# EAGLE schematic bc-module-bridge (EAGLE 7.7.0)

## Sheet 1 of 2
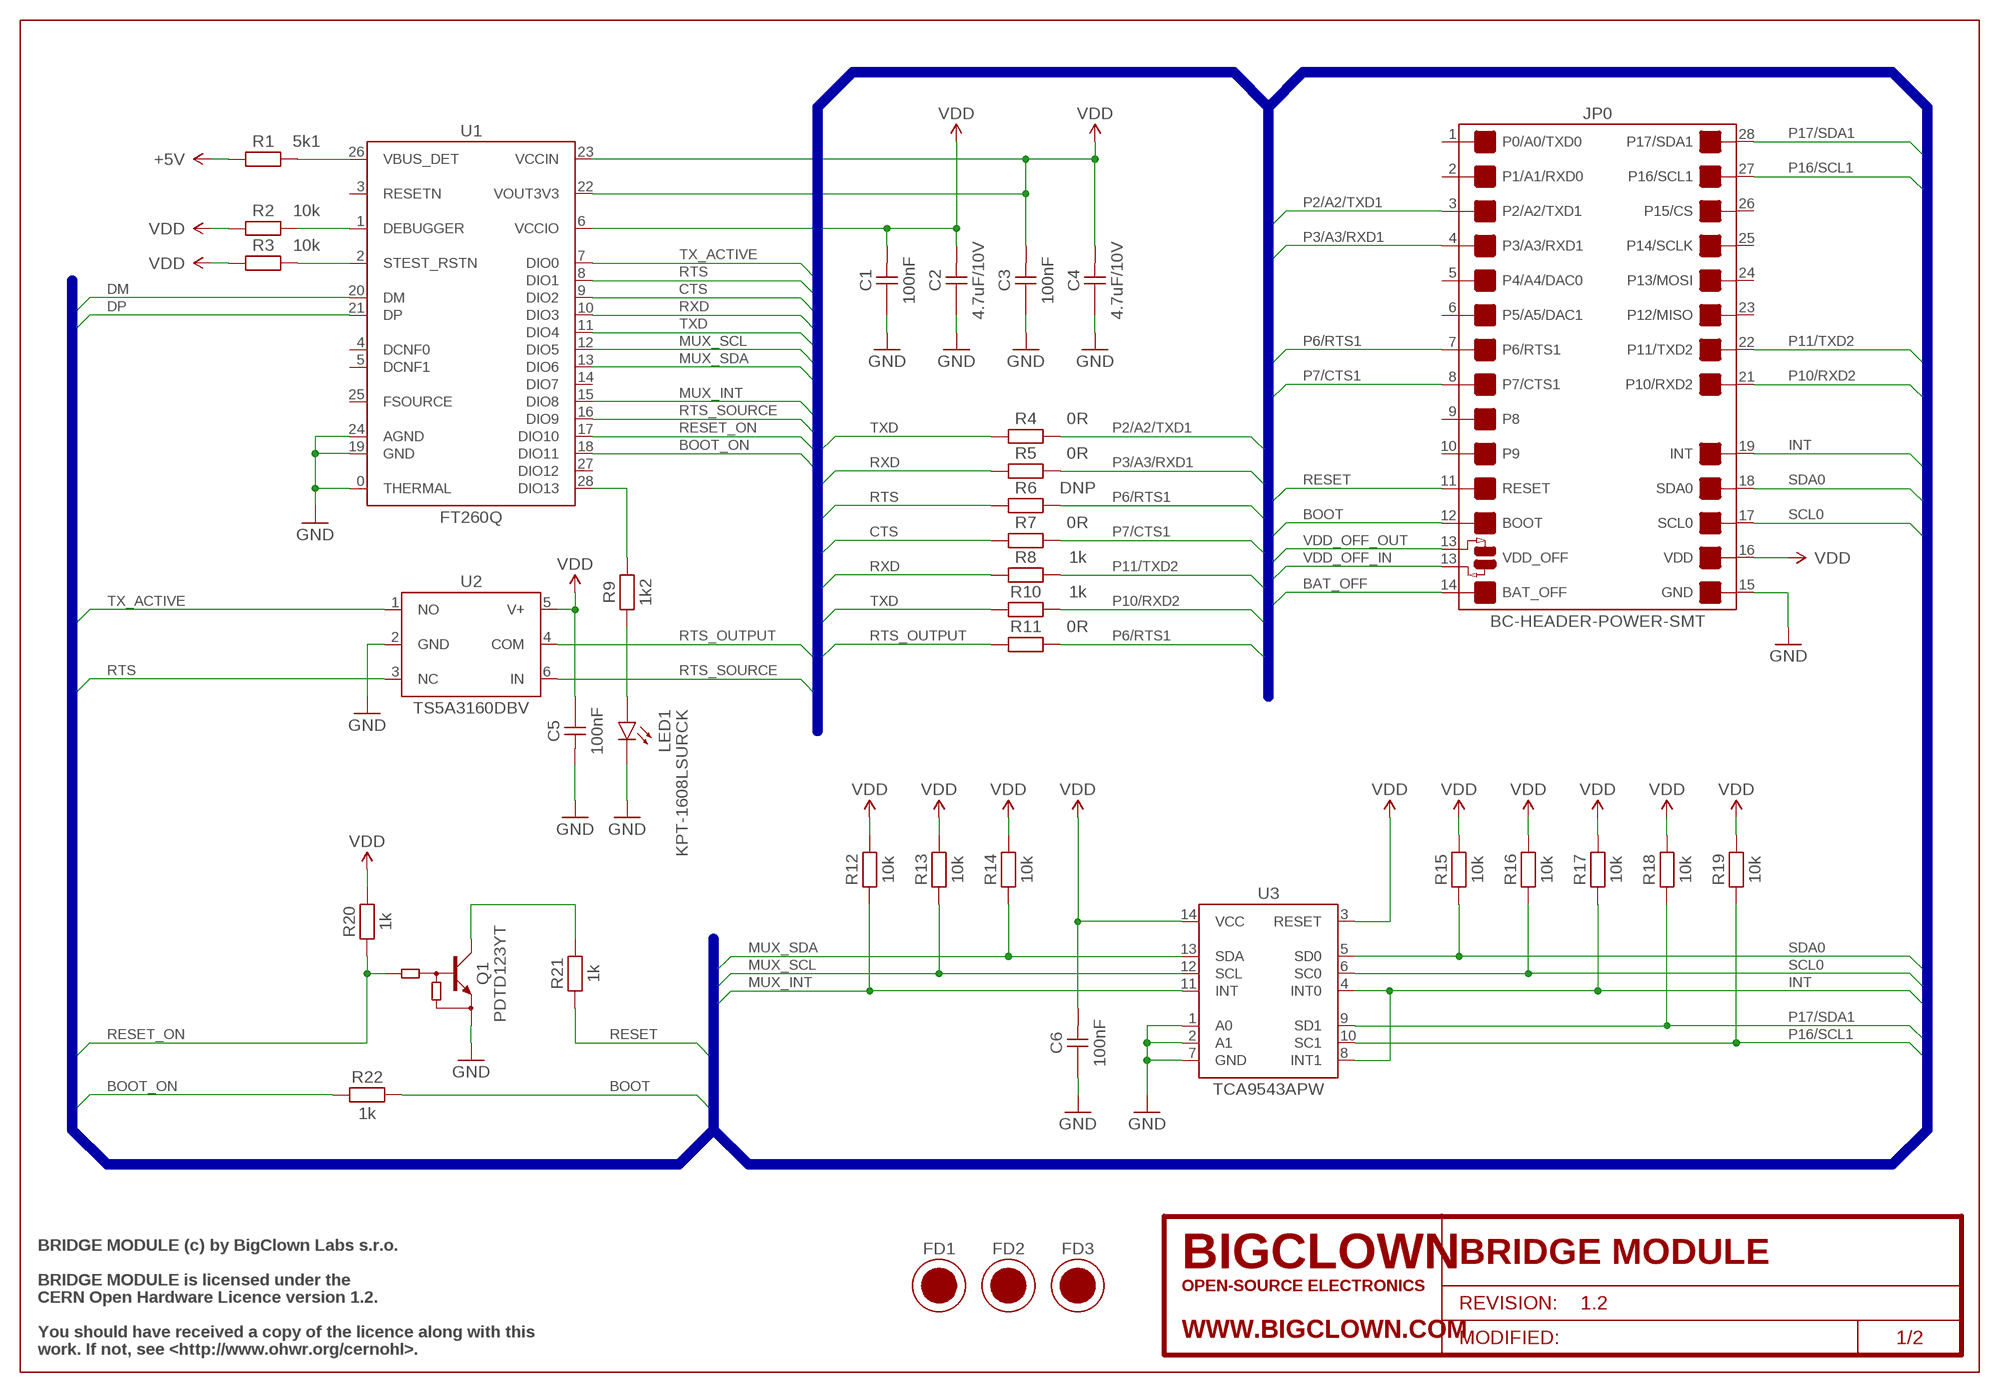
[diagram p0: schematic, sheet 1]

### Parts
C1  100nF  C-0603-100NF  [CAPACITOR-0603_R]
C2  4.7uF/10V  C-0603-4.7UF  [CAPACITOR-0603_R]
C3  100nF  C-0603-100NF  [CAPACITOR-0603_R]
C4  4.7uF/10V  C-0603-4.7UF  [CAPACITOR-0603_R]
C5  100nF  C-0603-100NF  [CAPACITOR-0603_R]
C6  100nF  C-0603-100NF  [CAPACITOR-0603_R]
FD1  FIDUCIAL  [FIDUCIAL-1MM]
FD2  FIDUCIAL  [FIDUCIAL-1MM]
FD3  FIDUCIAL  [FIDUCIAL-1MM]
FRAME1  FRAME-SCH/A4L-BRD/A4L  [FRAME-A4L]
JP0  BC-HEADER-POWER-SMT  [BC-HEADER-POWER-SMT]
LED1  KPT-1608LSURCK  LED-KPT-1608LSURCK  [KPT-1608LSURCK_R]
Q1  PDTD123YT  Q-PDTD123YT  [SOT-23_R]
R1  5k1  R-0603-5K1  [RESISTOR-0603_R]
R2  10k  R-0603-10K  [RESISTOR-0603_R]
R3  10k  R-0603-10K  [RESISTOR-0603_R]
R4  0R  R-0603-0R  [RESISTOR-0603_R]
R5  0R  R-0603-0R  [RESISTOR-0603_R]
R6  DNP  R-0603-DNP  [RESISTOR-0603_R]
R7  0R  R-0603-0R  [RESISTOR-0603_R]
R8  1k  R-0603-1K  [RESISTOR-0603_R]
R9  1k2  R-0603-1K2  [RESISTOR-0603_R]
R10  1k  R-0603-1K  [RESISTOR-0603_R]
R11  0R  R-0603-0R  [RESISTOR-0603_R]
R12  10k  R-0603-10K  [RESISTOR-0603_R]
R13  10k  R-0603-10K  [RESISTOR-0603_R]
R14  10k  R-0603-10K  [RESISTOR-0603_R]
R15  10k  R-0603-10K  [RESISTOR-0603_R]
R16  10k  R-0603-10K  [RESISTOR-0603_R]
R17  10k  R-0603-10K  [RESISTOR-0603_R]
R18  10k  R-0603-10K  [RESISTOR-0603_R]
R19  10k  R-0603-10K  [RESISTOR-0603_R]
R20  1k  R-0603-1K  [RESISTOR-0603_R]
R21  1k  R-0603-1K  [RESISTOR-0603_R]
R22  1k  R-0603-1K  [RESISTOR-0603_R]
U1  FT260Q  U-FT260Q  [FT260Q_R]
U2  TS5A3160DBV  U-TS5A3160DBV  [TS5A3160DBV_R]
U3  TCA9543APW  U-TCA9543APW  [TCA9543APW_R]

### Nets
+5V: R1.1 ; also sheet 2
BAT_OFF: JP0.14(BAT_OFF) ; also sheet 2
BOOT: JP0.12(BOOT) R22.2
BOOT_ON: R22.1 U1.18(DIO11)
CTS: R7.1 U1.9(DIO2)
DEBUGGER: R2.2 U1.1(DEBUGGER)
DM: U1.20(DM) ; also sheet 2
DP: U1.21(DP) ; also sheet 2
GND: C1.2 C2.2 C3.2 C4.2 C5.1 C6.2 JP0.15(GND) LED1.C Q1.2(E) U1.0(THERMAL) U1.19(GND) U1.24(AGND) U2.2(GND) U3.1(A0) U3.2(A1) U3.7(GND) ; also sheet 2
INT: JP0.19(INT) R17.1 U3.4(INT0) U3.8(INT1)
MUX_INT: R12.1 U1.15(DIO8) U3.11(INT)
MUX_SCL: R13.1 U1.12(DIO5) U3.12(SCL)
MUX_SDA: R14.1 U1.13(DIO6) U3.13(SDA)
N$2: LED1.A R9.2
N$3: R9.1 U1.28(DIO13)
P2/A2/TXD1: JP0.3(P2/A2/TXD1) R4.2
P3/A3/RXD1: JP0.4(P3/A3/RXD1) R5.2
P6/RTS1: JP0.7(P6/RTS1) R6.2 R11.2
P7/CTS1: JP0.8(P7/CTS1) R7.2
P10/RXD2: JP0.21(P10/RXD2) R10.2
P11/TXD2: JP0.22(P11/TXD2) R8.2
P16/SCL1: JP0.27(P16/SCL1) R19.1 U3.10(SC1)
P17/SDA1: JP0.28(P17/SDA1) R18.1 U3.9(SD1)
RESET: JP0.11(RESET) R21.2
RESET_ON: Q1.1(B) R20.1 U1.17(DIO10)
RESET_ON#: Q1.3(C) R21.1
RTS: R6.1 U1.8(DIO1) U2.3(NC)
RTS_OUTPUT: R11.1 U2.4(COM)
RTS_SOURCE: U1.16(DIO9) U2.6(IN)
RXD: R5.1 R8.1 U1.10(DIO3)
SCL0: JP0.17(SCL0) R16.1 U3.6(SC0)
SDA0: JP0.18(SDA0) R15.1 U3.5(SD0)
STEST_RSTN: R3.2 U1.2(STEST_RSTN)
TX_ACTIVE: U1.7(DIO0) U2.1(NO)
TXD: R4.1 R10.1 U1.11(DIO4)
VBUS_DET: R1.2 U1.26(VBUS_DET)
VDD: C1.1 C2.1 C3.1 C4.1 C5.2 C6.1 JP0.16(VDD) R2.1 R3.1 R12.2 R13.2 R14.2 R15.2 R16.2 R17.2 R18.2 R19.2 R20.2 U1.6(VCCIO) U1.22(VOUT3V3) U1.23(VCCIN) U2.5(V+) U3.3(RESET) U3.14(VCC) ; also sheet 2
VDD_OFF_IN: JP0.13B(VDD_OFF_OUT) ; also sheet 2
VDD_OFF_OUT: JP0.13T(VDD_OFF_IN) ; also sheet 2
Unconnected: JP0.1(P0/A0/TXD0) JP0.2(P1/A1/RXD0) JP0.5(P4/A4/DAC0) JP0.6(P5/A5/DAC1) JP0.9(P8) JP0.10(P9) JP0.23(P12/MISO) JP0.24(P13/MOSI) JP0.25(P14/SCLK) JP0.26(P15/CS) U1.3(RESETN) U1.4(DCNF0) U1.5(DCNF1) U1.14(DIO7) U1.25(FSOURCE) U1.27(DIO12)

### Buses
GND,VDD,VDD_OFF_OUT,VDD_OFF_IN,BAT_OFF,RESET,BOOT,INT,SDA0,SCL0,P2/A2/TXD1,P3/A3/RXD1,P6/RTS1,P7/CTS1,P10/RXD2,P11/TXD2,P16/SCL1,P17/SDA1,MUX_INT,MUX_SDA,MUX_SCL,RTS_SOURCE,RTS_OUTPUT,TX_ACTIVE,TXD,RXD,RTS,CTS,RESET_ON,BOOT_ON,+5V,DM,DP

### Notes on the sheet
- BRIDGE MODULE (c) by BigClown Labs s.r.o.
- BRIDGE MODULE is licensed under the
- CERN Open Hardware Licence version 1.2.
- You should have received a copy of the licence along with this
- work. If not, see <http://www.ohwr.org/cernohl>.

## Sheet 2 of 2
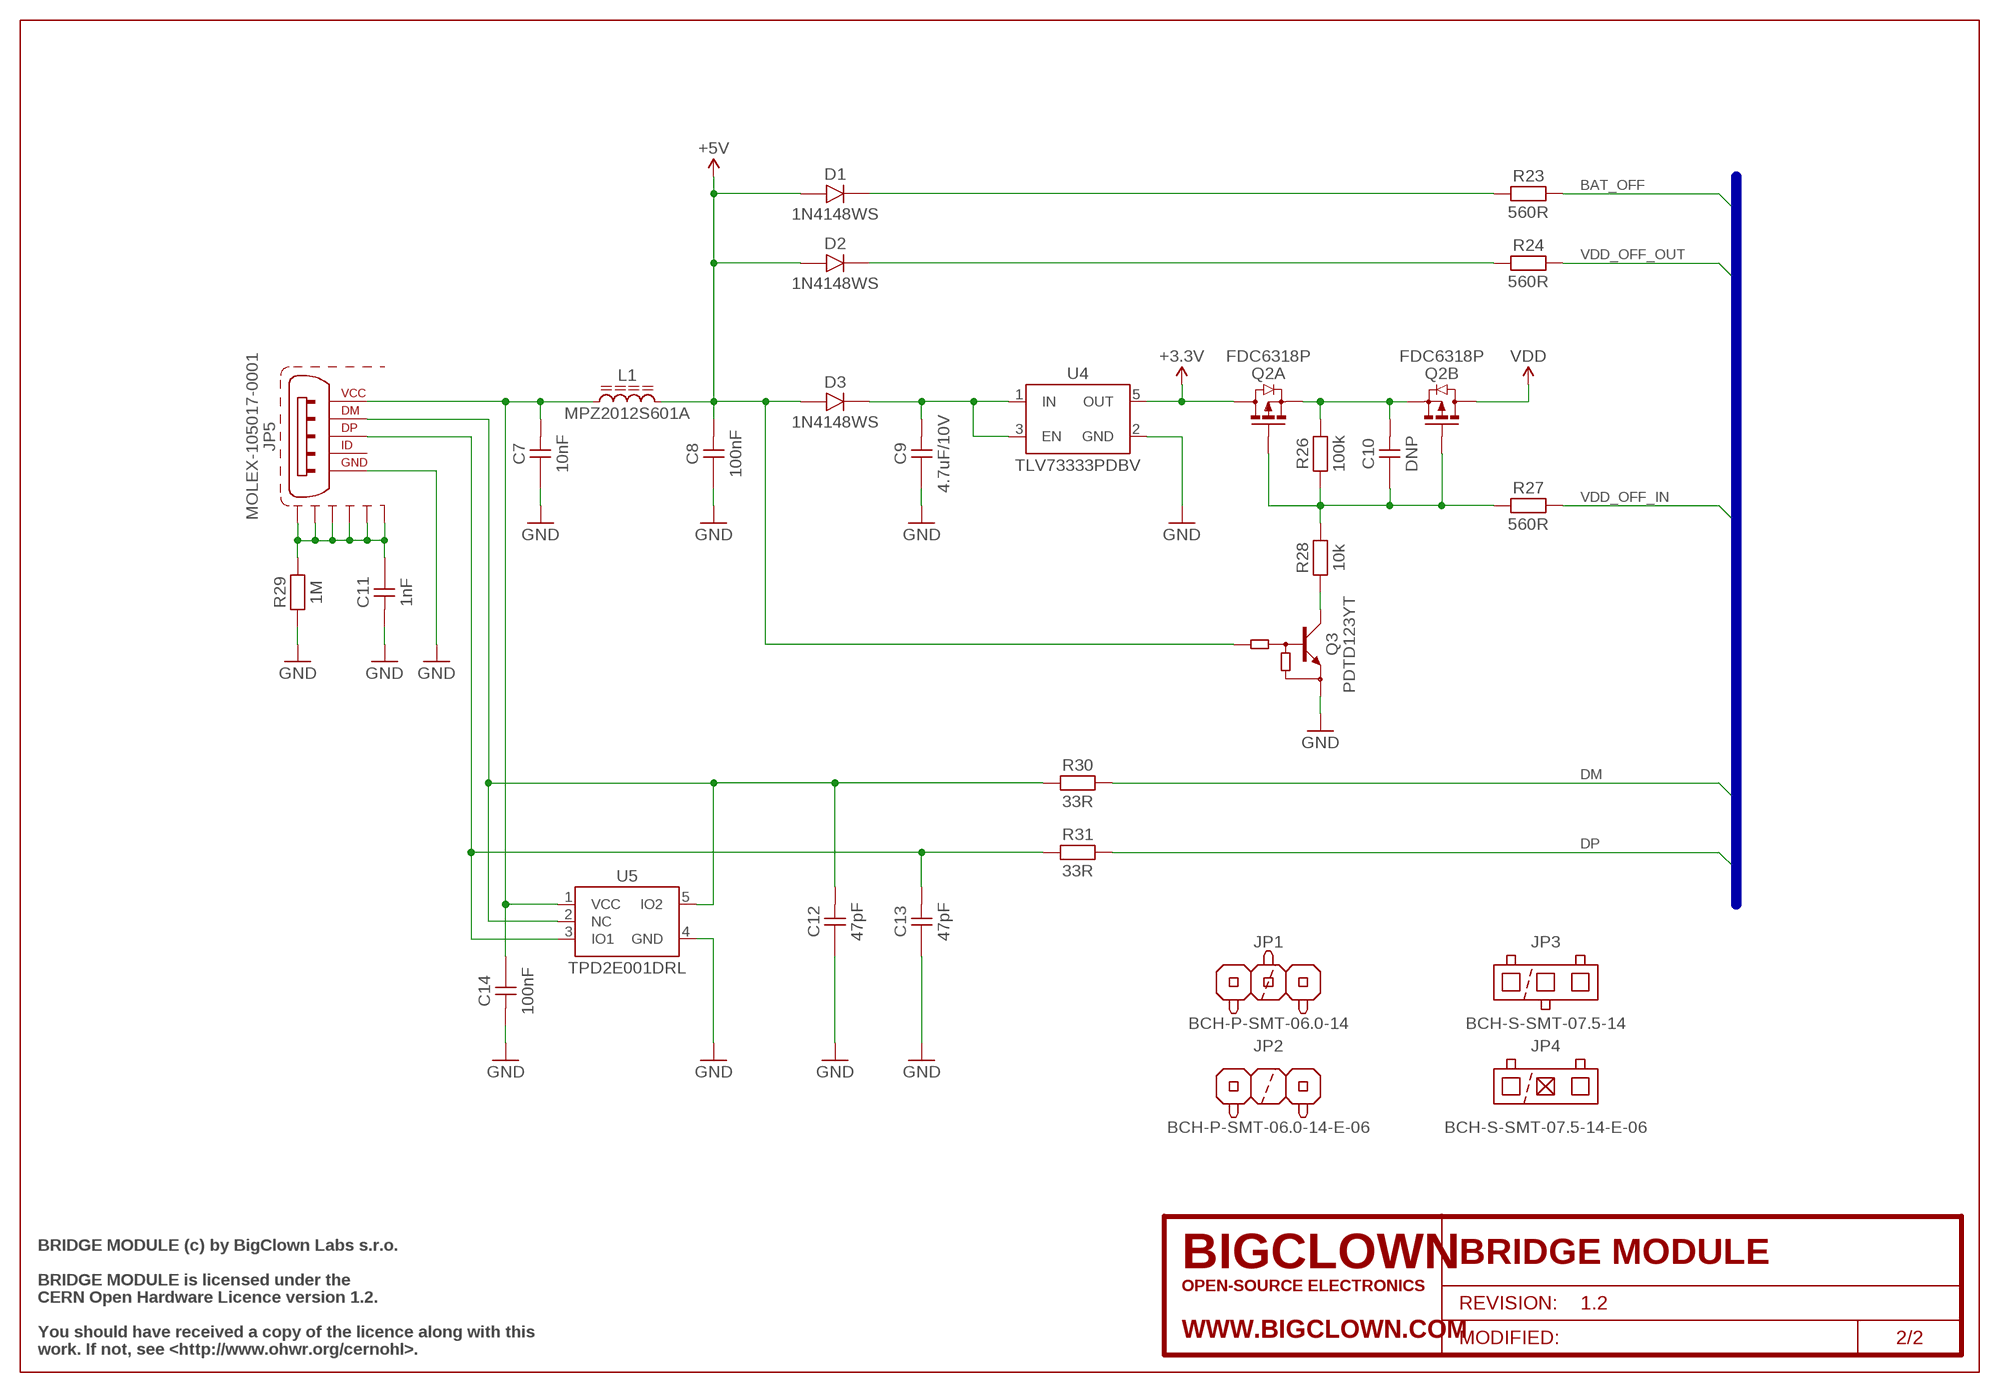
[diagram p1: schematic, sheet 2]
FRAME2 (FRAME-SCH/A4L-BRD/NONE): BCPN: -; PROJECT_NAME: BRIDGE MODULE; PROJECT_REVISION: 1.2

### Parts
C7  10nF  C-0805-10NF  [CAPACITOR-0805_R]
C8  100nF  C-0805-100NF  [CAPACITOR-0805_R]
C9  4.7uF/10V  C-0603-4.7UF  [CAPACITOR-0603_R]
C10  DNP  C-0603-DNP  [CAPACITOR-0603_R]
C11  1nF  C-1206-1NF  [CAPACITOR-1206_R]
C12  47pF  C-0603-47PF  [CAPACITOR-0603_R]
C13  47pF  C-0603-47PF  [CAPACITOR-0603_R]
C14  100nF  C-1206-100NF  [CAPACITOR-1206_R]
D1  1N4148WS  D-1N4148WS  [SOD-323_R]
D2  1N4148WS  D-1N4148WS  [SOD-323_R]
D3  1N4148WS  D-1N4148WS  [SOD-323_R]
JP1  BCH-P-SMT-06.0-14  JP-BCH-P-SMT-06.0-14  [BCH-P-SMT-14]
JP2  BCH-P-SMT-06.0-14-E-06  JP-BCH-P-SMT-06.0-14-E-06  [BCH-P-SMT-14-E-06]
JP3  BCH-S-SMT-07.5-14  JP-BCH-S-SMT-07.5-14  [BCH-S-SMT-14]
JP4  BCH-S-SMT-07.5-14-E-06  JP-BCH-S-SMT-07.5-14-E-06  [BCH-S-SMT-14-E-06]
JP5  MOLEX-105017-0001  JP-MOLEX-105017-0001  [MOLEX-105017-0001_R]
L1  MPZ2012S601A  L-MPZ2012S601A  [INDUCTOR-0805_R]
Q2  FDC6318P  Q-FDC6318P  [SSOT-6L_R]
Q3  PDTD123YT  Q-PDTD123YT  [SOT-23_R]
R23  560R  R-0603-560R  [RESISTOR-0603_R]
R24  560R  R-0603-560R  [RESISTOR-0603_R]
R26  100k  R-0603-100K  [RESISTOR-0603_R]
R27  560R  R-0603-560R  [RESISTOR-0603_R]
R28  10k  R-0603-10K  [RESISTOR-0603_R]
R29  1M  R-1206-1M  [RESISTOR-1206_R]
R30  33R  R-0603-33R  [RESISTOR-0603_R]
R31  33R  R-0603-33R  [RESISTOR-0603_R]
U4  TLV73333PDBV  U-TLV73333PDBV  [TLV73333PDBV_R]
U5  TPD2E001DRL  U-TPD2E001DRL  [TPD2E001DRL_R]

### Nets
+3.3V: Q2.6(A:D) U4.5(OUT)
+5V: C8.1 D1.2(A) D2.2(A) D3.2(A) L1.2 Q3.1(B) ; also sheet 1
+5V_RECTIFIED_BAT_OFF: D1.1(C) R23.1
+5V_RECTIFIED_LDO: C9.1 D3.1(C) U4.1(IN) U4.3(EN)
+5V_RECTIFIED_VDD_OFF_OUT: D2.1(C) R24.1
BAT_OFF: R23.2 ; also sheet 1
DM: R30.2 ; also sheet 1
DP: R31.2 ; also sheet 1
GND: C7.2 C8.2 C9.2 C11.1 C12.2 C13.2 C14.1 JP5.5 Q3.2(E) R29.1 U4.2(GND) U5.4(GND) ; also sheet 1
SHIELD: C11.2 JP5.S1 JP5.S2 JP5.S3 JP5.S4 JP5.S5 JP5.S6 R29.2
USB_DM: C12.1 JP5.2 R30.1 U5.2(NC) U5.5(IO2)
USB_DP: C13.1 JP5.3 R31.1 U5.3(IO1)
USB_VCC: C7.1 C14.2 JP5.1 L1.1 U5.1(VCC)
VDD: Q2.4(B:D) ; also sheet 1
VDD_OFF_IN: R27.2 ; also sheet 1
VDD_OFF_IN_C: Q3.3(C) R28.1
VDD_OFF_IN_G: C10.2 Q2.1(A:G) Q2.3(B:G) R26.1 R27.1 R28.2
VDD_OFF_OUT: R24.2 ; also sheet 1
VDD_S: C10.1 Q2.2(B:S) Q2.5(A:S) R26.2
Unconnected: JP5.4

### Buses
GND,VDD,VDD_OFF_OUT,VDD_OFF_IN,BAT_OFF,RESET,BOOT,INT,SDA0,SCL0,P2/A2/TXD1,P3/A3/RXD1,P6/RTS1,P7/CTS1,P10/RXD2,P11/TXD2,P16/SCL1,P17/SDA1,MUX_INT,MUX_SDA,MUX_SCL,RTS_SOURCE,RTS_OUTPUT,TX_ACTIVE,TXD,RXD,RTS,CTS,RESET_ON,BOOT_ON,+5V,DM,DP

### Notes on the sheet
- BRIDGE MODULE (c) by BigClown Labs s.r.o.
- BRIDGE MODULE is licensed under the
- CERN Open Hardware Licence version 1.2.
- You should have received a copy of the licence along with this
- work. If not, see <http://www.ohwr.org/cernohl>.

## Library data of the parts
C1 C3 C5 C6 = bc-capacitor:C-0603-100NF; BCPN: BC-C-0603-100NF
C2 C4 C9 = bc-capacitor:C-0603-4.7UF; BCPN: BC-C-0603-4.7UF
C7 = bc-capacitor:C-0805-10NF; BCPN: BC-C-0805-10NF
C8 = bc-capacitor:C-0805-100NF; BCPN: BC-C-0805-100NF
C10 = bc-capacitor:C-0603-DNP; BCPN: -
C11 = bc-capacitor:C-1206-1NF; BCPN: BC-C-1206-1NF
C12 C13 = bc-capacitor:C-0603-47PF; BCPN: BC-C-0603-47PF
C14 = bc-capacitor:C-1206-100NF; BCPN: BC-C-1206-100NF
D1-D3 = bc-discrete:D-1N4148WS; BCPN: BC-D-1N4148WS
FD1-FD3 = bc-fiducial:FIDUCIAL; BCPN: -
FRAME1 = bc-frame:FRAME-SCH/A4L-BRD/A4L; BCPN: -; PROJECT_NAME: BRIDGE MODULE; PROJECT_REVISION: 1.2
JP0 = bc-header:BC-HEADER-POWER-SMT; BCPN: -
JP1 = bc-header:JP-BCH-P-SMT-06.0-14; BCPN: BC-JP-BCH-P-SMT-06.0-14
JP2 = bc-header:JP-BCH-P-SMT-06.0-14-E-06; BCPN: BC-JP-BCH-P-SMT-06.0-14-E-06
JP3 = bc-header:JP-BCH-S-SMT-07.5-14; BCPN: BC-JP-BCH-S-SMT-07.5-14
JP4 = bc-header:JP-BCH-S-SMT-07.5-14-E-06; BCPN: BC-JP-BCH-S-SMT-07.5-14-E-06
JP5 = bc-connector:JP-MOLEX-105017-0001; BCPN: BC-JP-MOLEX-105017-0001
L1 = bc-inductor:L-MPZ2012S601A; BCPN: BC-L-MPZ2012S601A
LED1 = bc-led:LED-KPT-1608LSURCK; BCPN: BC-LED-KPT-1608LSURCK
Q1 Q3 = bc-discrete:Q-PDTD123YT; BCPN: BC-Q-PDTD123YT
Q2 = bc-discrete:Q-FDC6318P; BCPN: BC-Q-FDC6318P
R1 = bc-resistor:R-0603-5K1; BCPN: BC-R-0603-5k1
R2 R3 R12-R19 R28 = bc-resistor:R-0603-10K; BCPN: BC-R-0603-10k
R4 R5 R7 R11 = bc-resistor:R-0603-0R; BCPN: BC-R-0603-0R
R6 = bc-resistor:R-0603-DNP; BCPN: -
R8 R10 R20-R22 = bc-resistor:R-0603-1K; BCPN: BC-R-0603-1k
R9 = bc-resistor:R-0603-1K2; BCPN: BC-R-0603-1k2
R23 R24 R27 = bc-resistor:R-0603-560R; BCPN: BC-R-0603-560R
R26 = bc-resistor:R-0603-100K; BCPN: BC-R-0603-100k
R29 = bc-resistor:R-1206-1M; BCPN: BC-R-1206-1M
R30 R31 = bc-resistor:R-0603-33R; BCPN: BC-R-0603-33R
U1 = bc-interface:U-FT260Q; BCPN: BC-U-FT260Q
U2 = bc-switch:U-TS5A3160DBV; BCPN: BC-U-TS5A3160DBV
U3 = bc-interface:U-TCA9543APW; BCPN: BC-U-TCA9543APW
U4 = bc-power:U-TLV73333PDBV; BCPN: BC-U-TLV73333PDBV
U5 = bc-protection:U-TPD2E001DRL; BCPN: BC-U-TPD2E001DRL